# Altium schematic sheet Control Board.SchDoc
size A4
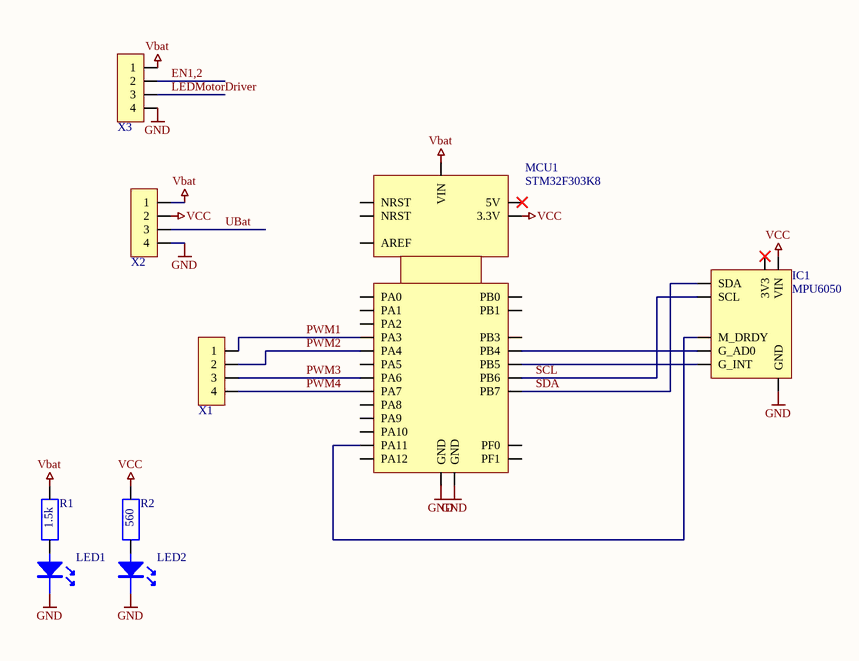
[diagram p0: Control Board.SchDoc]

## Parts
IC1  MPU6050  [MPU6050-Board]
LED1  APT3216CGCK  [LED_3216_GREEN]  (value not drawn)
LED2  APT3216CGCK  [LED_3216_GREEN]  (value not drawn)
MCU1  STM32F303K8  [Nucleo STM32F303K8]
R1  Comment_1: 1.5k  [0805_R]  (hidden comment: Chip Resistor 10k, 0805, 1%)
R2  Comment_1: 560  [0805_R]  (hidden comment: Chip Resistor 10k, 0805, 1%)
X1  Pin Header 4x1 2.54mm  [PTSM 0,5 4-2,5-H SMD]  (value not drawn)
X2  Pin Header 4x1 2.54mm  [PTSM 0,5 4-2,5-H SMD]  (value not drawn)
X3  Pin Header 4x1 2.54mm  [PTSM 0,5 4-2,5-H SMD]  (value not drawn)

## Nets
GND: IC1.3(GND) LED1.K LED2.K MCU1.4(GND) MCU1.17(GND) X2.4 X3.4
Vbat: MCU1.16(VIN) R1.2 X2.1 X3.1
VCC: IC1.1(VIN) MCU1.29(3.3V) R2.2 X2.2
EN1,2: X3.2
LEDMotorDriver: X3.3
PWM1: MCU1.25(PA3) X1.1
PWM2: MCU1.24(PA4) X1.2
PWM3: MCU1.22(PA6) X1.3
PWM4: MCU1.21(PA7) X1.4
SCL: IC1.4(SCL) MCU1.8(PB6)
SDA: IC1.5(SDA) MCU1.7(PB7)
UBat: X2.3
NetIC1_6: IC1.6(M_DRDY) MCU1.13(PA11)
NetIC1_7: IC1.7(G_AD0) MCU1.15(PB4)
NetIC1_8: IC1.8(G_INT) MCU1.14(PB5)
NetLED1_A: LED1.A R1.1
NetLED2_A: LED2.A R2.1

Not connected (* = marked no-connect by the designer): IC1 2(3V3)*; MCU1 1(PA9) 2(PA10) 3(NRST) 5(PA12) 6(PB0) 9(PB1) 10(PF0) 11(PF1) 12(PA8) 18(NRST) 19(5V)* 20(PA2) 23(PA5) 26(PA1) 27(PA0) 28(AREF) 30(PB3)

## Library data of the parts
IC1 = MPU6050 Board: MPU6050 Sensor Board
LED1 LED2 = LED: LED SMD green APT3216CGCK; Manufacturer: Kingbright; Part Number: 604-APT3216CGCK; Comment_1: APT-3216CGCK; Footprint: 1206; Notes: -; Price: 0.4; Supplier 1: Mouser; Supplier Part Number 1: APT3216CGCK
MCU1 = Nucleo STM32F303K8
R1 R2 = RESISTOR: Resistor 10k 0.125W 0805; Manufacturer: Vishay; Part Number: CRCW080510K0FKEAC; Footprint: 0805; Supplier Part Number 1: 71-CRCW080510K0FKEAC; Price: 0.19; Supplier 1: Mouser
X1-X3 = PTSM 0,5/ 4-2,5-H SMD: PTSM 4 Pol; Manufacturer: Phoenix Contacdt; Part Number: 1814650; Supplier 1: Mouser; Supplier Part Number 1: 651-1814650; Price: 1.31